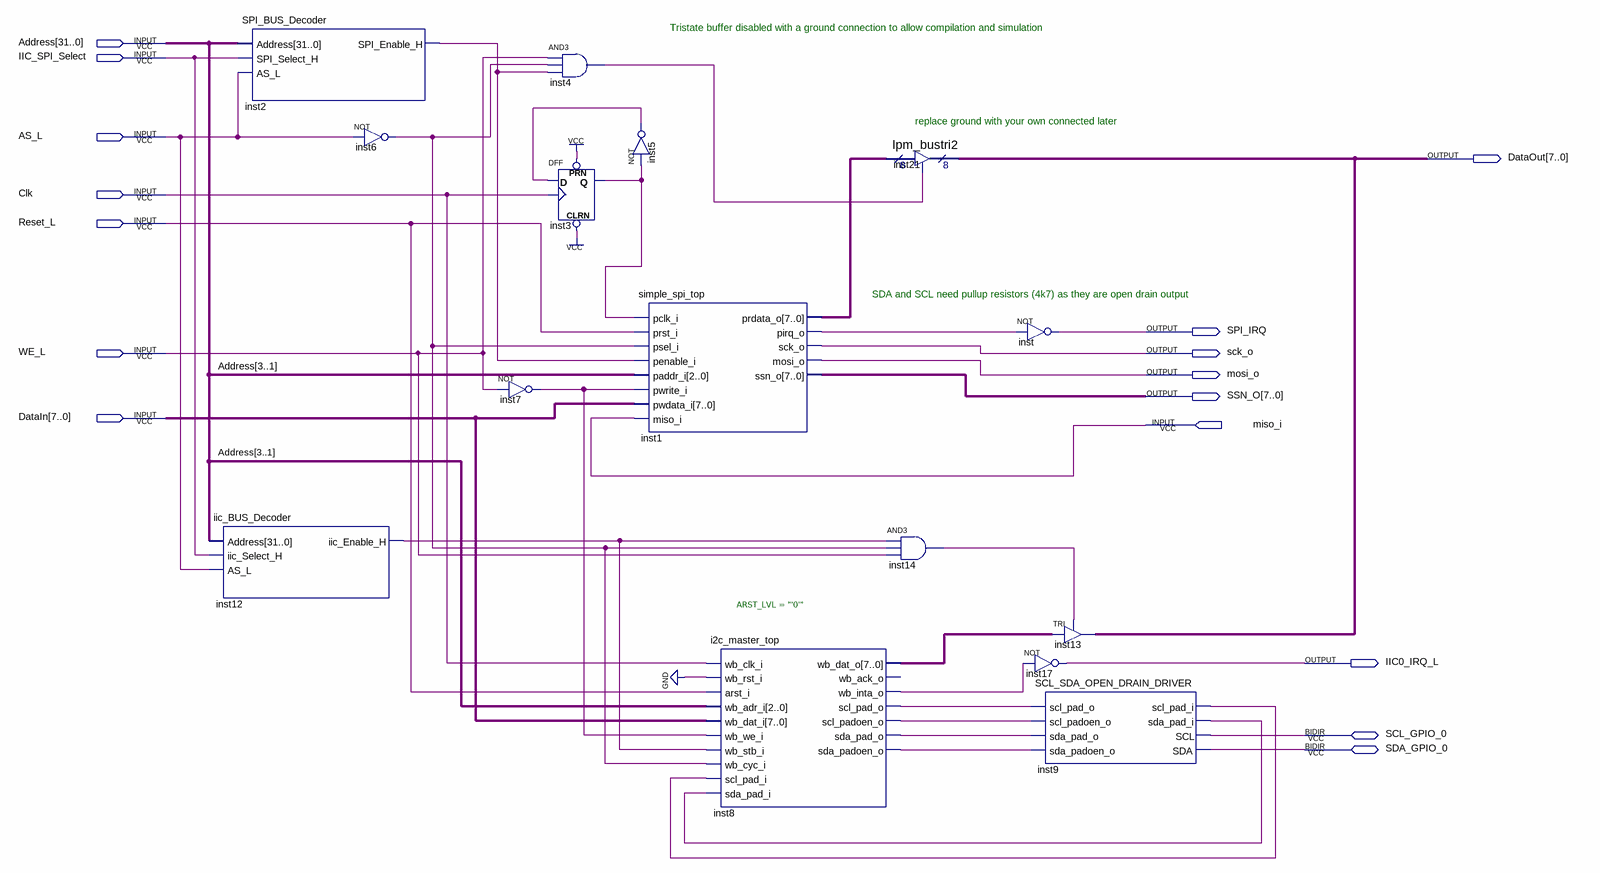
[diagram p0: schematic sheet]
// Quartus schematic IIC_SPI_Interface.bdf as structural Verilog: 15 symbols, 16 pins
module IIC_SPI_Interface (
  input  [31:0] Address,
  input  IIC_SPI_Select,
  input  AS_L,
  input  Clk,
  input  Reset_L,
  input  WE_L,
  input  [7:0] DataIn,
  input  miso_i,
  inout  SCL_GPIO_0,
  inout  SDA_GPIO_0,
  output [7:0] DataOut,
  output SPI_IRQ,
  output sck_o,
  output mosi_o,
  output [7:0] SSN_O,
  output IIC0_IRQ_L
);

  wire inst1_pirq_o, inst2_spi_enable_h, inst3_q, inst4_out, inst5_out, inst6_out, inst7_out,
       inst8_scl_pad_o, inst8_scl_padoen_o, inst8_sda_pad_o, inst8_sda_padoen_o, inst8_wb_inta_o,
       inst9_scl_pad_i, inst9_sda_pad_i, inst12_iic_enable_h, inst14_out;
  wire [7:0] inst1_prdata_o, inst8_wb_dat_o;

  SPI_BUS_Decoder inst2 (
    .Address(Address), .SPI_Select_H(IIC_SPI_Select), .AS_L(AS_L), .SPI_Enable_H(inst2_spi_enable_h));
  iic_BUS_Decoder inst12 (
    .Address(Address), .iic_Select_H(IIC_SPI_Select), .AS_L(AS_L), .iic_Enable_H(inst12_iic_enable_h));
  not inst6 (inst6_out, AS_L);
  not inst7 (inst7_out, WE_L);
  and inst4 (inst4_out, WE_L, inst6_out, inst2_spi_enable_h);
  DFF inst3 (.CLRN(1'b1), .CLK(Clk), .D(inst5_out), .PRN(1'b1), .Q(inst3_q));
  not inst5 (inst5_out, inst3_q);
  simple_spi_top inst1 (
    .pclk_i(inst3_q), .prst_i(Reset_L), .psel_i(inst6_out), .penable_i(inst2_spi_enable_h),
    .paddr_i(Address[3:1]), .pwrite_i(inst7_out), .pwdata_i(DataIn), .miso_i(miso_i),
    .prdata_o(inst1_prdata_o), .pirq_o(inst1_pirq_o), .sck_o(sck_o), .mosi_o(mosi_o), .ssn_o(SSN_O));
  i2c_master_top #(.ARST_LVL("'0'")) inst8 (
    .wb_clk_i(Clk), .wb_rst_i(1'b0), .arst_i(Reset_L), .wb_adr_i(Address[3:1]), .wb_dat_i(DataIn),
    .wb_we_i(inst7_out), .wb_stb_i(inst12_iic_enable_h), .wb_cyc_i(inst6_out), .scl_pad_i(inst9_scl_pad_i),
    .sda_pad_i(inst9_sda_pad_i), .wb_dat_o(inst8_wb_dat_o), .wb_inta_o(inst8_wb_inta_o),
    .scl_pad_o(inst8_scl_pad_o), .scl_padoen_o(inst8_scl_padoen_o), .sda_pad_o(inst8_sda_pad_o),
    .sda_padoen_o(inst8_sda_padoen_o));  // open: wb_ack_o
  lpm_bustri2 inst21 (.enabledt(inst4_out), .data(inst1_prdata_o), .tridata(DataOut));
  and inst14 (inst14_out, inst12_iic_enable_h, inst6_out, WE_L);
  not inst (SPI_IRQ, inst1_pirq_o);
  not inst17 (IIC0_IRQ_L, inst8_wb_inta_o);
  SCL_SDA_OPEN_DRAIN_DRIVER inst9 (
    .scl_pad_o(inst8_scl_pad_o), .scl_padoen_o(inst8_scl_padoen_o), .sda_pad_o(inst8_sda_pad_o),
    .sda_padoen_o(inst8_sda_padoen_o), .scl_pad_i(inst9_scl_pad_i), .sda_pad_i(inst9_sda_pad_i),
    .SCL(SCL_GPIO_0), .SDA(SDA_GPIO_0));
  TRI inst13[7:0] (.IN(inst8_wb_dat_o), .OE(inst14_out), .OUT(DataOut));

  // Notes on the sheet:
  //   Tristate buffer disabled with a ground connection to allow compilation and simulation
  //   replace ground with your own connected later
  //   SDA and SCL need pullup resistors (4k7) as they are open drain output
endmodule
